# Altium project converter 1000v.PrjPcb
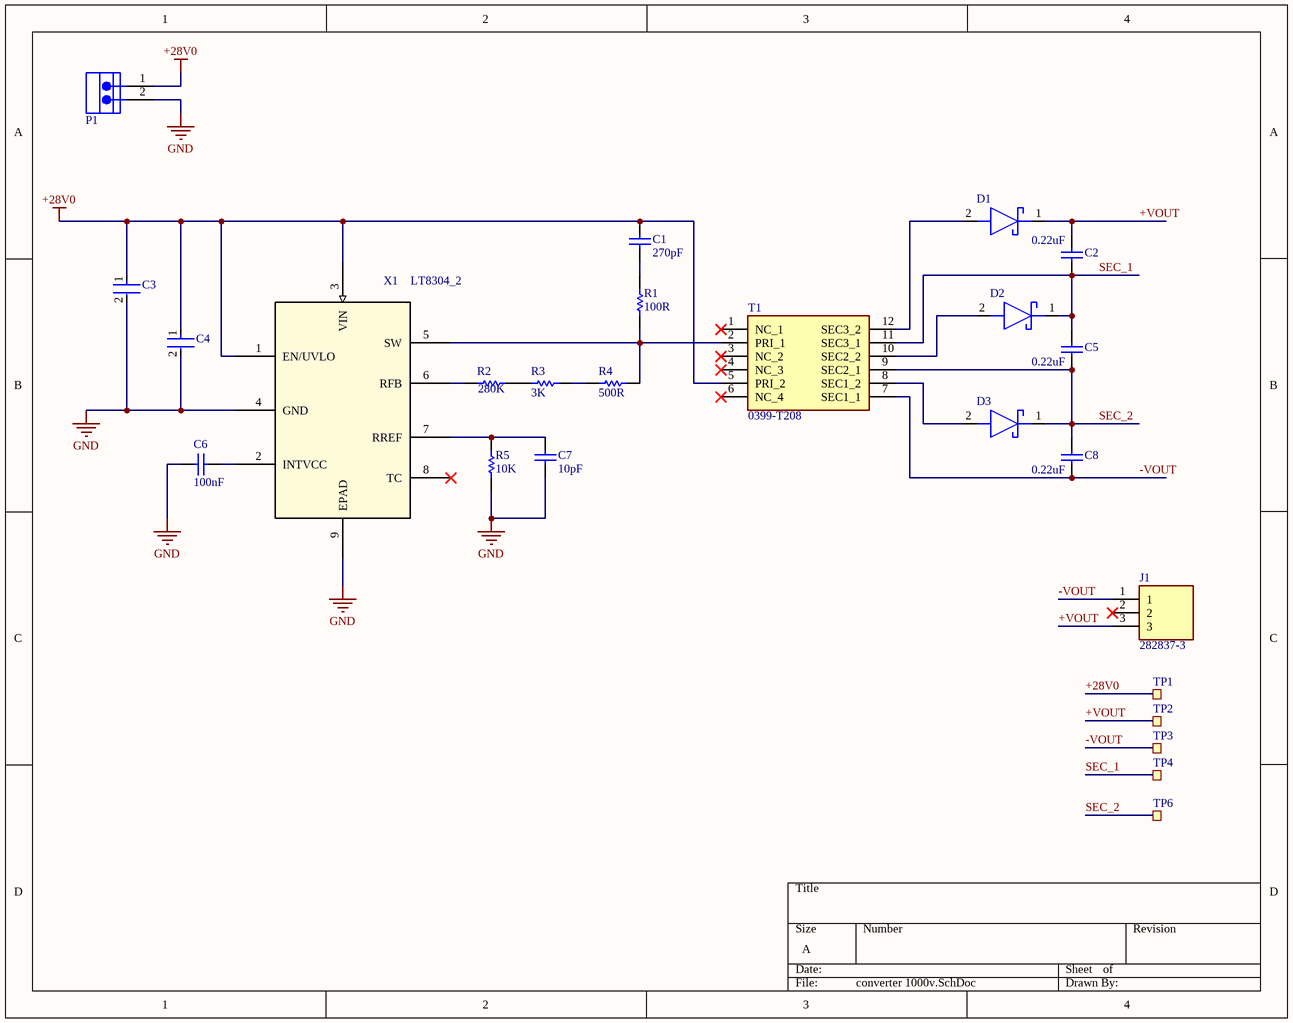
[diagram p0: converter 1000v.SchDoc]
1 sheet, 25 parts. Net scope: global (net labels, ports and power ports of the same name join across sheets).
Board file: converter 1000v.PcbDoc

## Sheet converter 1000v.SchDoc
size A; SheetNumber: 1; SheetTotal: 1

### Parts
C1  270pF  [CAP0603]
C2  value 0.22uF  [Cap0.22]  (hidden comment: Cap)
C3  C3216X7R1H106K160AC  [FP-C3216-160-0_3-MFG]  (value not drawn)
C4  C3216X7R1H106K160AC  [FP-C3216-160-0_3-MFG]  (value not drawn)
C5  value 0.22uF  [Cap0.22]  (hidden comment: Cap)
C6  100nF  [CAP0603]
C7  10pF  [CAP0603]
C8  value 0.22uF  [Cap0.22]  (hidden comment: Cap)
D1  CMMR1U-08_TR_PBFREE  [SODFL3818X108N]  (value not drawn)
D2  CMMR1U-08_TR_PBFREE  [SODFL3818X108N]  (value not drawn)
D3  CMMR1U-08_TR_PBFREE  [SODFL3818X108N]  (value not drawn)
J1  282837-3  [2828373]
P1  Socket Blue 2  [Socket Blue 2]  (value not drawn)
R1  100R  [RES0603_(1608X06L)]
R2  280K  [RES0603_(1608X06L)]
R3  3K  [RES0603_(1608X06L)]
R4  500R  [RES0603_(1608X06L)]
R5  10K  [RES0603_(1608X06L)]
T1  0399-T208  [0399T208]
TP1  Ø1.5mm,SMD  [TP_SMD_Ø1.5mm]  (value not drawn)  (no BOM)
TP2  Ø1.5mm,SMD  [TP_SMD_Ø1.5mm]  (value not drawn)  (no BOM)
TP3  Ø1.5mm,SMD  [TP_SMD_Ø1.5mm]  (value not drawn)  (no BOM)
TP4  Ø1.5mm,SMD  [TP_SMD_Ø1.5mm]  (value not drawn)  (no BOM)
TP6  Ø1.5mm,SMD  [TP_SMD_Ø1.5mm]  (value not drawn)  (no BOM)
X1  LT8304_2  [S_8E_ADI-M]

### Nets
+28V0: C1.2 C3.1 C4.1 P1.1 T1.5(PRI_2) TP1.1 X1.1(EN/UVLO) X1.3(VIN)
GND: C3.2 C4.2 C6.2 C7.2 P1.2 R5.1 X1.4(GND) X1.9(EPAD)
+VOUT: C2.2 D1.1(K) J1.3 TP2.1
-VOUT: C8.1 J1.1 T1.7(SEC1_1) TP3.1
SEC_1: C2.1 C5.2 D2.1(K) T1.11(SEC3_1) TP4.1
SEC_2: C5.1 C8.2 D3.1(K) T1.9(SEC2_1) TP6.1
NetC1_1: C1.1 R1.2
NetC6_1: C6.1 X1.2(INTVCC)
NetC7_1: C7.1 R5.2 X1.7(RREF)
NetD1_2: D1.2(A) T1.12(SEC3_2)
NetD2_2: D2.2(A) T1.10(SEC2_2)
NetD3_2: D3.2(A) T1.8(SEC1_2)
NetR1_1: R1.1 R4.2 T1.2(PRI_1) X1.5(SW)
NetR2_1: R2.1 X1.6(RFB)
NetR2_2: R2.2 R3.1
NetR3_2: R3.2 R4.1

Not connected (* = marked no-connect by the designer): J1 2*; T1 1(NC_1)* 3(NC_2)* 4(NC_3)* 6(NC_4)*; X1 8(TC)*

### Library data of the parts
C1 C6 C7 = CAP SMD PACKAGE: TOTAL CAPACITOR SMD PACK; Designer: Abbas Basereh; Desc.: CAP SMD TOTAL PACKAGES; Data: 2017-3-10
  C1: VALUE: 270pF
  C6: VALUE: 100nF
  C7: VALUE: 10pF
C2 C5 C8 = Cap: Capacitor; Published: 8-Jun-2000; LatestRevisionDate: 17-Jul-2002; LatestRevisionNote: Re-released for DXP Platform.; PackageReference: RAD-0.3; Publisher: Altium Limited; PackageDescription: Radial Cap, Thru-Hole; 2 Leads; 0.3 in Pin Spacing
C3 C4 = CMP-08246-004811-1: Multilayer Ceramic Capacitors 10uF ±10% 50V X7R SMD 1206; RoHS Compliant: Yes
D1-D3 = CMMR1U-08_TR_PBFREE: Schottky Diode; Manufacturer_Name: Central Semiconductor; Manufacturer_Part_Number: CMMR1U-08 TR PBFREE; Datasheet Link: https://my.centralsemi.com/get_document.php?cmp=1&mergetype=pd&mergepath=pd&pdf_id=CMMR1U_SERIES.PDF; Height: 1.08mm; Mouser Part Number: 610-CMMR1U-08TR; Mouser Price/Stock: https://www.mouser.co.uk/ProductDetail/Central-Semiconductor/CMMR1U-08-TR-PBFREE?qs=u16ybLDytRacktF8B597og%3D%3D; Arrow Part Number: CMMR1U-08 TR PBFREE; Arrow Price/Stock: https://www.arrow.com/en/products/cmmr1u-08-tr-pbfree/central-semiconductor?utm_currency=USD&region=nac
J1 = 282837-3: Connector; Manufacturer_Name: TE Connectivity; Datasheet Link: https://www.te.com/commerce/DocumentDelivery/DDEController?Action=srchrtrv&DocNm=1-1773458-1_EURO_STYLE_QRG&DocType=Data%20Sheet&DocLang=English&PartCntxt=282837-3&DocFormat=pdf; Height: 10.3mm; Manufacturer_Part_Number: 282837-3; Mouser Part Number: 571-2828373; Mouser Price/Stock: https://www.mouser.co.uk/ProductDetail/TE-Connectivity/282837-3?qs=A%252Bip%252BNCYi6PMRxtBYEOSrQ%3D%3D; Arrow Part Number: 282837-3; Arrow Price/Stock: https://www.arrow.com/en/products/282837-3/te-connectivity?utm_currency=USD&region=europe
R1-R5 = RES SMD PACKAGE: TOTAL SMD RESISTOR PACK; Designer: Abbas Basereh; Desc.: RES SMD PAKAGES; Data: 2017-3-10
T1 = 0399-T208: Transformer; Manufacturer_Name: Sumida; Datasheet Link: https://products.sumida.com/products/pdf/CEFD2010(0399-T208)_Ver1.0_E.pdf; Height: 11.8mm; Manufacturer_Part_Number: 0399-T208; Arrow Part Number: 0399-T208; Arrow Price/Stock: https://www.arrow.com/en/products/0399-t208/sumida?utm_currency=USD&region=nac
TP1-TP4 TP6 = TP_SMD_Ø1.5MM: 1.5mm circular SMD testpad; Manufacturer: Nordic Semiconductor; Manufacturer Part Number: N.A.; Pad Count: 1; Part Number: TP_SMD_Ø1.5MM; LatestRevisionDate: 2016-06-02; Published: 2016-06-02; Value: Ø1.5mm,SMD; Note: N.A.; Artikkelnr Noca: N.A.; Footprint Doc: TP_SMD_Ø1.5mm; Part number IPS: N.A.; ComponentLink1URL: N.A.; ComponentLink1Description: Datasheet; ComponentLink2URL: N.A.; ComponentLink2Description: Supplier link; HelpURL: N.A.; Supplier 1: N.A.; Supplier Part Number 1: N.A.; Supplier 2: N.A.; Supplier Part Number 2: N.A.; Component Class: Connectors; PartId: 100500477
P1 = Socket Blue 2: ComponentLink1Description: Tarahiboard; ComponentLink1URL: https://www.tarahiboard.com/product/library-pack; DatasheetVersion: 2022